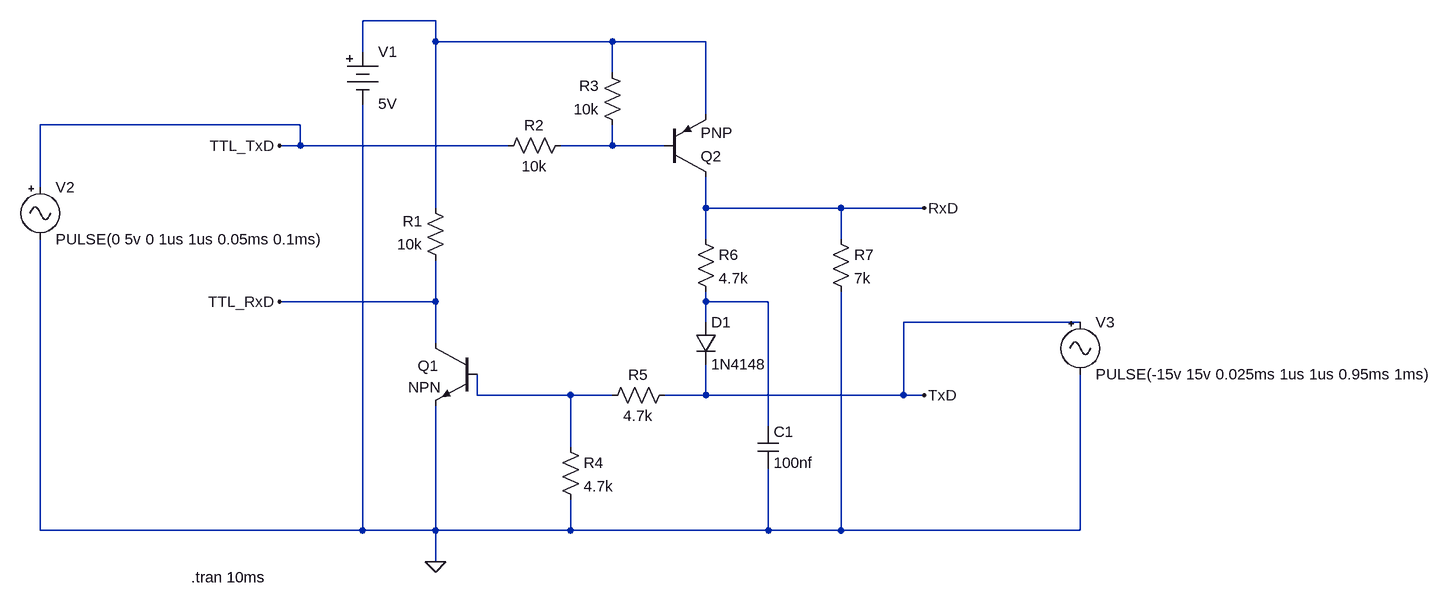
[diagram p0: schematic ltspice.asc]
ltspice.asc, the LTspice schematic file:
Version 4
SHEET 1 1812 680
WIRE 176 -416 64 -416
WIRE 176 -384 176 -416
WIRE 448 -384 176 -384
WIRE 592 -384 448 -384
WIRE 64 -368 64 -416
WIRE 448 -336 448 -384
WIRE 592 -272 592 -384
WIRE -32 -256 -432 -256
WIRE -32 -224 -32 -256
WIRE -32 -224 -64 -224
WIRE 288 -224 -32 -224
WIRE 448 -224 448 -256
WIRE 448 -224 368 -224
WIRE 528 -224 448 -224
WIRE -432 -160 -432 -256
WIRE 176 -128 176 -384
WIRE 592 -128 592 -176
WIRE 800 -128 592 -128
WIRE 928 -128 800 -128
WIRE 592 -80 592 -128
WIRE 800 -80 800 -128
WIRE 176 16 176 -48
WIRE 176 16 -64 16
WIRE 592 16 592 0
WIRE 688 16 592 16
WIRE 592 48 592 16
WIRE 1168 48 896 48
WIRE 176 80 176 16
WIRE 240 160 240 128
WIRE 384 160 240 160
WIRE 448 160 384 160
WIRE 592 160 592 112
WIRE 592 160 528 160
WIRE 896 160 896 48
WIRE 896 160 592 160
WIRE 928 160 896 160
WIRE 688 208 688 16
WIRE 384 240 384 160
WIRE -432 368 -432 -80
WIRE 64 368 64 -288
WIRE 64 368 -432 368
WIRE 176 368 176 176
WIRE 176 368 64 368
WIRE 384 368 384 320
WIRE 384 368 176 368
WIRE 688 368 688 272
WIRE 688 368 384 368
WIRE 800 368 800 0
WIRE 800 368 688 368
WIRE 1168 368 1168 128
WIRE 1168 368 800 368
WIRE 176 416 176 368
FLAG 176 416 0
FLAG 928 -128 RxD
FLAG 928 160 TxD
FLAG -64 -224 TTL_TxD
FLAG -64 16 TTL_RxD
SYMBOL npn 240 80 M0
WINDOW 0 59 35 Left 2
SYMATTR InstName Q1
SYMBOL pnp 528 -176 M180
SYMATTR InstName Q2
SYMBOL res 576 -96 R0
SYMATTR InstName R6
SYMATTR Value 4.7k
SYMBOL res 368 224 R0
SYMATTR InstName R4
SYMATTR Value 4.7k
SYMBOL res 544 144 R90
WINDOW 0 0 56 VBottom 2
WINDOW 3 32 56 VTop 2
SYMATTR InstName R5
SYMATTR Value 4.7k
SYMBOL diode 576 48 R0
SYMATTR InstName D1
SYMATTR Value 1N4148
SYMBOL cap 672 208 R0
SYMATTR InstName C1
SYMATTR Value 100nf
SYMBOL res 192 -32 R180
WINDOW 0 36 76 Left 2
WINDOW 3 36 40 Left 2
SYMATTR InstName R1
SYMATTR Value 10k
SYMBOL res 384 -240 R90
WINDOW 0 0 56 VBottom 2
WINDOW 3 32 56 VTop 2
SYMATTR InstName R2
SYMATTR Value 10k
SYMBOL res 464 -240 R180
WINDOW 0 36 76 Left 2
WINDOW 3 36 40 Left 2
SYMATTR InstName R3
SYMATTR Value 10k
SYMBOL Misc\\battery 64 -384 R0
SYMATTR InstName V1
SYMATTR Value 5V
SYMBOL Misc\\signal -432 -176 R0
WINDOW 123 0 0 Left 2
WINDOW 39 0 0 Left 2
SYMATTR InstName V2
SYMATTR Value PULSE(0 5v 0 1us 1us 0.05ms 0.1ms)
SYMBOL Misc\\signal 1168 32 R0
WINDOW 123 0 0 Left 2
WINDOW 39 0 0 Left 2
SYMATTR InstName V3
SYMATTR Value PULSE(-15v 15v 0.025ms 1us 1us 0.95ms 1ms)
SYMBOL res 784 -96 R0
SYMATTR InstName R7
SYMATTR Value 7k
TEXT -200 440 Left 2 !.tran 10ms

The netlist it stands for:
* ltspice.asc
Q1 TTL_RxD N004 0 0 NPN
Q2 RxD N002 N001 0 PNP
R6 RxD N003 4.7k
R4 N004 0 4.7k
R5 TxD N004 4.7k
D1 N003 TxD 1N4148
C1 N003 0 100nf
R1 TTL_RxD N001 10k
R2 N002 TTL_TxD 10k
R3 N002 N001 10k
V1 N001 0 5V
V2 TTL_TxD 0 PULSE(0 5v 0 1us 1us 0.05ms 0.1ms)
V3 TxD 0 PULSE(-15v 15v 0.025ms 1us 1us 0.95ms 1ms)
R7 RxD 0 7k
.model D D
.lib standard.dio
.model NPN NPN
.model PNP PNP
.lib standard.bjt
.tran 10ms
.backanno
.end